# Altium schematic sheet wifi_ESP8266.SchDoc: WiFi Interface ESP8266
size A4
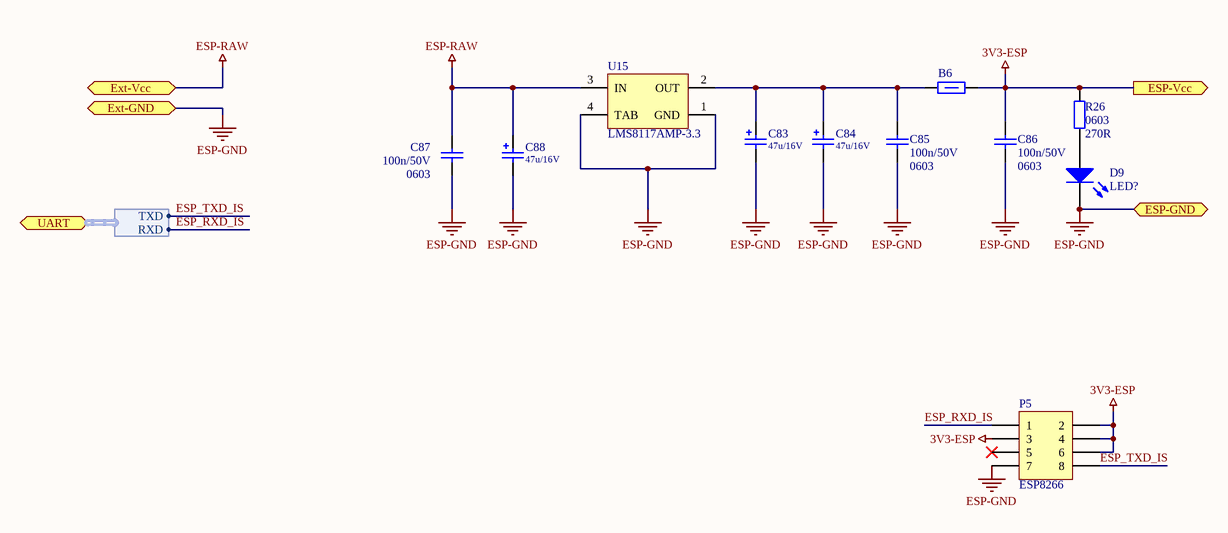
[diagram p0: wifi_ESP8266.SchDoc]

## Parts
B6  120R/100MHz  [SMD_FerriteBead_1206]  (value not drawn)
C83  47u/16V  [Tantalum_cap_B]
C84  47u/16V  [Tantalum_cap_B]
C85  Package: 0603  [SMD_Capacitor_0603]  (hidden comment: 100n/50V)
C86  Package: 0603  [SMD_Capacitor_0603]  (hidden comment: 100n/50V)
C87  Package: 0603  [SMD_Capacitor_0603]  (hidden comment: 100n/50V)
C88  47u/16V  [Tantalum_cap_B]
D9  LED?  [LED 0805 RED]
P5  ESP8266  [HEADER 2X4 FEMALE]
R26  0603  value 270R  [SMD_Resistor_0603]
U15  LMS8117AMP-3.3  [MP04A_M]

## Ports
ESP-GND, ESP-Vcc (out), Ext-GND, Ext-Vcc, UART (harness UART)

## Harnesses
UART: TXD, RXD

## Nets
3V3-ESP: B6.2 C86.1 P5.2 P5.3 P5.4 P5.6 R26.1 ; port ESP-Vcc
ESP-GND: C83.2 C84.2 C85.2 C86.2 C87.2 C88.2 D9.2(K) P5.7 U15.1(GND) U15.4(TAB) ; port ESP-GND, port Ext-GND
ESP-RAW: C87.1 C88.1 U15.3(IN) ; port Ext-Vcc
ESP_RXD_IS: P5.1 ; port UART.RXD
ESP_TXD_IS: P5.8 ; port UART.TXD
NetB6_1: B6.1 C83.1 C84.1 C85.1 U15.2(OUT)
NetD9_1: D9.1(A) R26.2

Not connected (* = marked no-connect by the designer): P5 5*

## Notes on the sheet
- Title:
- Sheet:
- of
- Author:
- Model:
- Document Number:
- Checked by:
- Iss-Rev:
- Approved by:
- Date:
- File name:

## Library data of the parts
B6 = BLM31PG121SH1L: Ferrite bead, 1206, 0.02HM, 3.5A.; Manufacturer: Murata; Current Rating: 3.5A; Series Resistance DC: 0.02R; Package: 1206; Value: 120R/100MHz; ManufacturerPartNumber: BLM31PG121SH1L
C83 C84 C88 = Cap Tantalum: Tantalum Capacitor; Value: 47u/16V
C85-C87 = Cer_C0603T104K5RALTU: Ceramic Cap Kemet COTS 100n/50V X7R 0603; Manufacturer: Kemet; ManufacturerPartNumber: C0603T104K5RALTU; Value: 100n/50V
D9 = LED3: Typical BLUE SiC LED; Published: 8-Jun-2000; LatestRevisionDate: 17-Dec-2003; LatestRevisionNote: PCB Footprint replaced.; DatasheetVersion: 16-Apr-2002; PackageVersion: 16-Apr-2002; PackageReference: 3.5X2.8X1.9; Publisher: Altium Limited; PackageDescription: SM LED; 2 C-Bend Leads; Body 3.5 x 2.8 x 1.9 mm, inc leads (LxWxH typ)
P5 = Header 4X2: Header, 4-Pin, Dual row; LatestRevisionDate: 17-Jul-2002; LatestRevisionNote: Re-released for DXP Platform.; Publisher: Altium Limited
R26 = Res2: Resistor; Published: 8-Jun-2000; LatestRevisionDate: 17-Jul-2002; LatestRevisionNote: Re-released for DXP Platform.; PackageReference: AXIAL-0.4; Publisher: Altium Limited; PackageDescription: Axial Device, Thru-Hole; 2 Leads; 0.4 in Pin Spacing
U15 = LMS8117AMP-3.3: 1A Low-Dropout Linear Regulator, 4-pin SOT-223; Manufacturer: National Semiconductor; PackageTopMarking: XYTT*LS01; PowerWise: N; CompType: LDO IC; High-Reliability: Y; DatasheetVersion: Apr-2005; PackageVersion: revB, Apr-2003; PackageReference: MP04A; PackageDescription: Molded SOT-223, 6.50 x 3.56 x 1.6mm Body, 4 Lead, 2.3mm Pitch; PartNumber: LMS8117AMP-3.3; RoHS: N; PinCount: 4; Code_JEDEC: TO-261-AA; Code_IPC: SOT223-4; ComponentLink1Description: Manufacturer URL; ComponentLink1URL: http://www.national.com/; ComponentLink2Description: LMS8117A Datasheet; ComponentLink2URL: http://www.national.com/ds/LM/LMS8117A.pdf; ComponentLink3Description: LMS8117A Web Page; ComponentLink3URL: http://www.national.com/pf/LM/LMS8117A.html; ComponentLink4Description: MP04A Package Page; ComponentLink4URL: http://www.national.com/packaging/folders/mp04a.html